# Altium schematic sheet CurrentMeasure_Diagram.SchDoc
size A; SheetNumber: 1; SheetTotal: 4
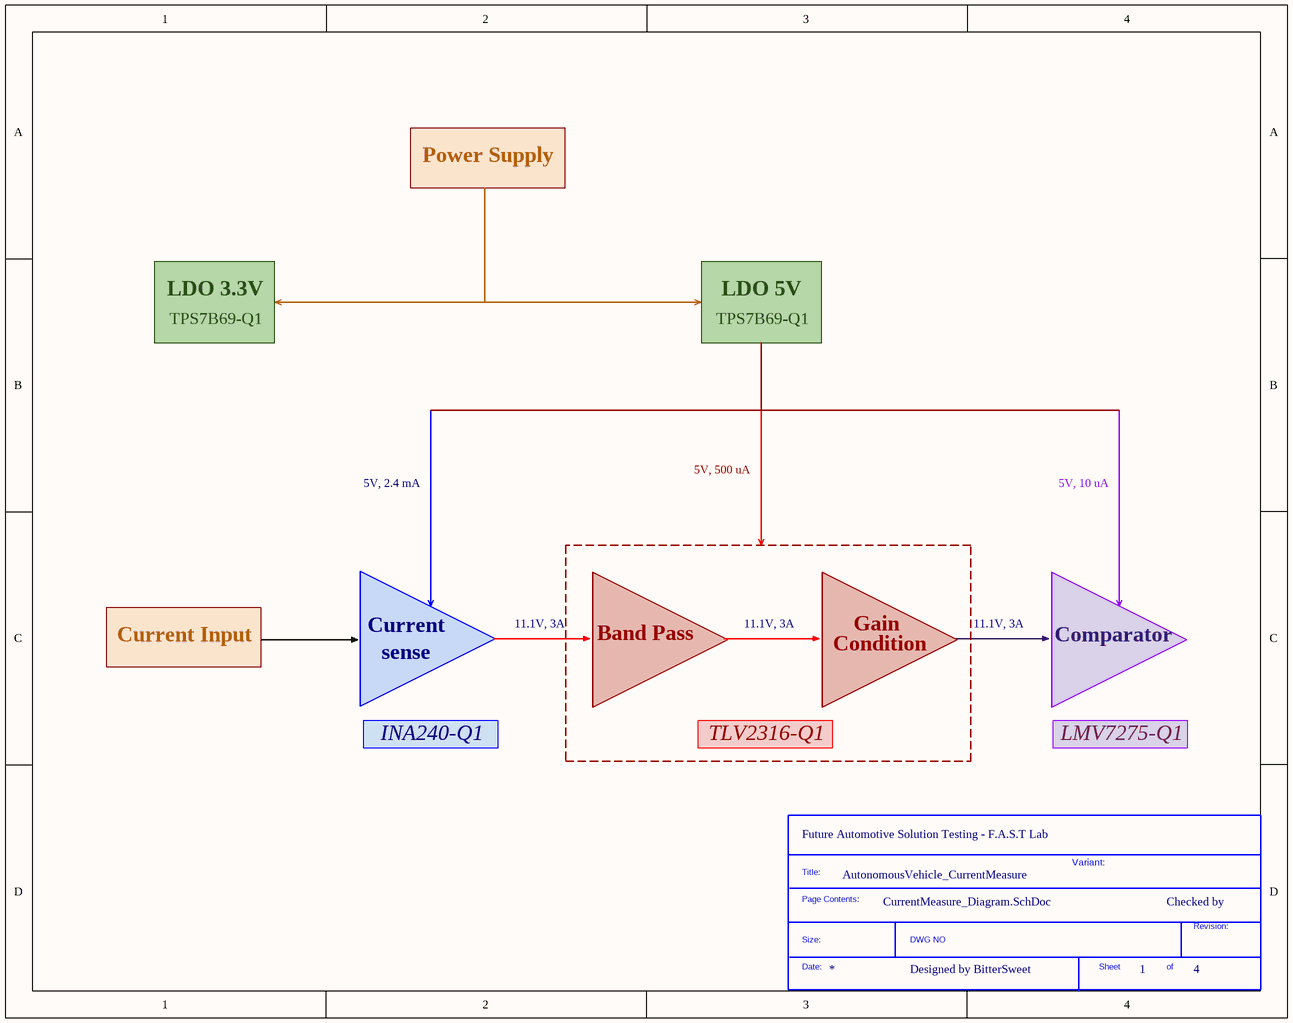
[diagram p0: CurrentMeasure_Diagram.SchDoc]

## Parts
*?  SDTitleBlock  (value not drawn)  (graphical)

## Notes on the sheet
- Power Supply
- LDO 3.3V
- LDO 5V
- TPS7B69-Q1
- 5V, 2.4 mA
- 5V, 500 uA
- 5V, 10 uA
- Current
- 11.1V, 3A
- Band Pass
- Gain
- Current Input
- sense
- Condition
- Comparator
- INA240-Q1
- TLV2316-Q1
- LMV7275-Q1
- (near *?) Future Automotive Solution Testing - F.A.S.T Lab
- AutonomousVehicle_CurrentMeasure
- Variant:
- Checked by
- Designed by BitterSweet
- (in symbol SDTitleBlock) Title:; Page Contents:; Revision:; Size:; DWG NO; Date:; Sheet; of